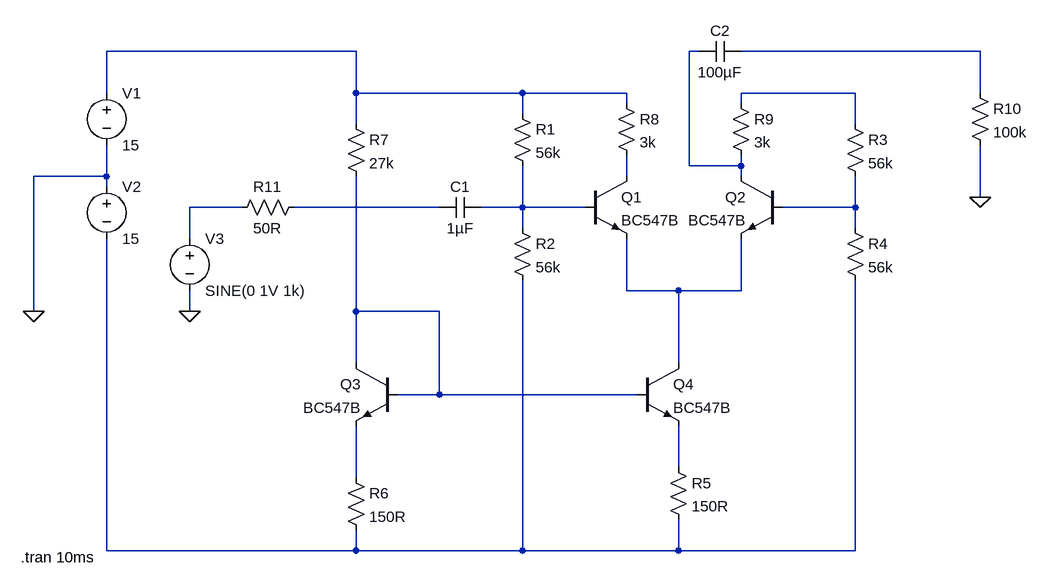
[diagram p0: schematic diferencial-amplifier.asc]
diferencial-amplifier.asc, the LTspice schematic file:
Version 4
SHEET 1 880 700
WIRE -208 -96 -592 -96
WIRE 320 -96 304 -96
WIRE 752 -96 384 -96
WIRE -592 -32 -592 -96
WIRE -208 -32 -208 -96
WIRE 48 -32 -208 -32
WIRE 208 -32 48 -32
WIRE 560 -32 384 -32
WIRE 752 -32 752 -96
WIRE 208 -16 208 -32
WIRE 384 -16 384 -32
WIRE 48 0 48 -32
WIRE -208 16 -208 -32
WIRE 560 16 560 -32
WIRE 304 80 304 -96
WIRE 384 80 384 64
WIRE 384 80 304 80
WIRE -592 96 -592 48
WIRE -592 96 -704 96
WIRE 208 96 208 64
WIRE 384 96 384 80
WIRE -592 112 -592 96
WIRE 752 128 752 48
WIRE -384 144 -464 144
WIRE -80 144 -304 144
WIRE 48 144 48 80
WIRE 48 144 -16 144
WIRE 144 144 48 144
WIRE 560 144 560 96
WIRE 560 144 448 144
WIRE 48 176 48 144
WIRE 560 176 560 144
WIRE -464 192 -464 144
WIRE 208 272 208 192
WIRE 288 272 208 272
WIRE 384 272 384 192
WIRE 384 272 288 272
WIRE -704 304 -704 96
WIRE -464 304 -464 272
WIRE -208 304 -208 96
WIRE -80 304 -208 304
WIRE -208 384 -208 304
WIRE 288 384 288 272
WIRE -80 432 -80 304
WIRE -80 432 -144 432
WIRE 224 432 -80 432
WIRE 288 544 288 480
WIRE -208 560 -208 480
WIRE -592 672 -592 192
WIRE -208 672 -208 640
WIRE -208 672 -592 672
WIRE 48 672 48 256
WIRE 48 672 -208 672
WIRE 288 672 288 624
WIRE 288 672 48 672
WIRE 560 672 560 256
WIRE 560 672 288 672
FLAG -464 304 0
FLAG -704 304 0
FLAG 752 128 0
SYMBOL npn 144 96 R0
SYMATTR InstName Q1
SYMATTR Value BC547B
SYMBOL npn 448 96 M0
SYMATTR InstName Q2
SYMATTR Value BC547B
SYMBOL npn -144 384 M0
SYMATTR InstName Q3
SYMATTR Value BC547B
SYMBOL npn 224 384 R0
SYMATTR InstName Q4
SYMATTR Value BC547B
SYMBOL res 32 -16 R0
SYMATTR InstName R1
SYMATTR Value 56k
SYMBOL res 32 160 R0
SYMATTR InstName R2
SYMATTR Value 56k
SYMBOL res 544 0 R0
SYMATTR InstName R3
SYMATTR Value 56k
SYMBOL res 544 160 R0
SYMATTR InstName R4
SYMATTR Value 56k
SYMBOL res 272 528 R0
SYMATTR InstName R5
SYMATTR Value 150R
SYMBOL res -224 544 R0
SYMATTR InstName R6
SYMATTR Value 150R
SYMBOL res -224 0 R0
SYMATTR InstName R7
SYMATTR Value 27k
SYMBOL cap -16 128 R90
WINDOW 0 0 32 VBottom 2
WINDOW 3 32 32 VTop 2
SYMATTR InstName C1
SYMATTR Value 1µF
SYMBOL cap 384 -112 R90
WINDOW 0 0 32 VBottom 2
WINDOW 3 32 32 VTop 2
SYMATTR InstName C2
SYMATTR Value 100µF
SYMBOL res 192 -32 R0
SYMATTR InstName R8
SYMATTR Value 3k
SYMBOL res 368 -32 R0
SYMATTR InstName R9
SYMATTR Value 3k
SYMBOL voltage -592 -48 R0
WINDOW 123 0 0 Left 0
WINDOW 39 0 0 Left 0
SYMATTR InstName V1
SYMATTR Value 15
SYMBOL voltage -592 96 R0
WINDOW 123 0 0 Left 0
WINDOW 39 0 0 Left 0
SYMATTR InstName V2
SYMATTR Value 15
SYMBOL voltage -464 176 R0
WINDOW 123 0 0 Left 0
WINDOW 39 0 0 Left 0
SYMATTR InstName V3
SYMATTR Value SINE(0 1V 1k)
SYMBOL res 736 -48 R0
SYMATTR InstName R10
SYMATTR Value 100k
SYMBOL res -288 128 R90
WINDOW 0 0 56 VBottom 2
WINDOW 3 32 56 VTop 2
SYMATTR InstName R11
SYMATTR Value 50R
TEXT -724 682 Left 2 !.tran 10ms

The netlist it stands for:
* diferencial-amplifier.asc
Q1 N005 N008 N010 0 BC547B
Q2 N002 N009 N010 0 BC547B
Q3 N011 N011 N013 0 BC547B
Q4 N010 N011 N012 0 BC547B
R1 N001 N008 56k
R2 N008 N014 56k
R3 N004 N009 56k
R4 N009 N014 56k
R5 N012 N014 150R
R6 N013 N014 150R
R7 N001 N011 27k
C1 N008 N007 1µF
C2 N003 N002 100µF
R8 N001 N005 3k
R9 N004 N002 3k
V1 N001 0 15
V2 0 N014 15
V3 N006 0 SINE(0 1V 1k)
R10 N003 0 100k
R11 N007 N006 50R
.model NPN NPN
.model PNP PNP
.lib standard.bjt
.tran 10ms
.backanno
.end